# Altium schematic sheet USBPowerv1.0.SchDoc
size A3
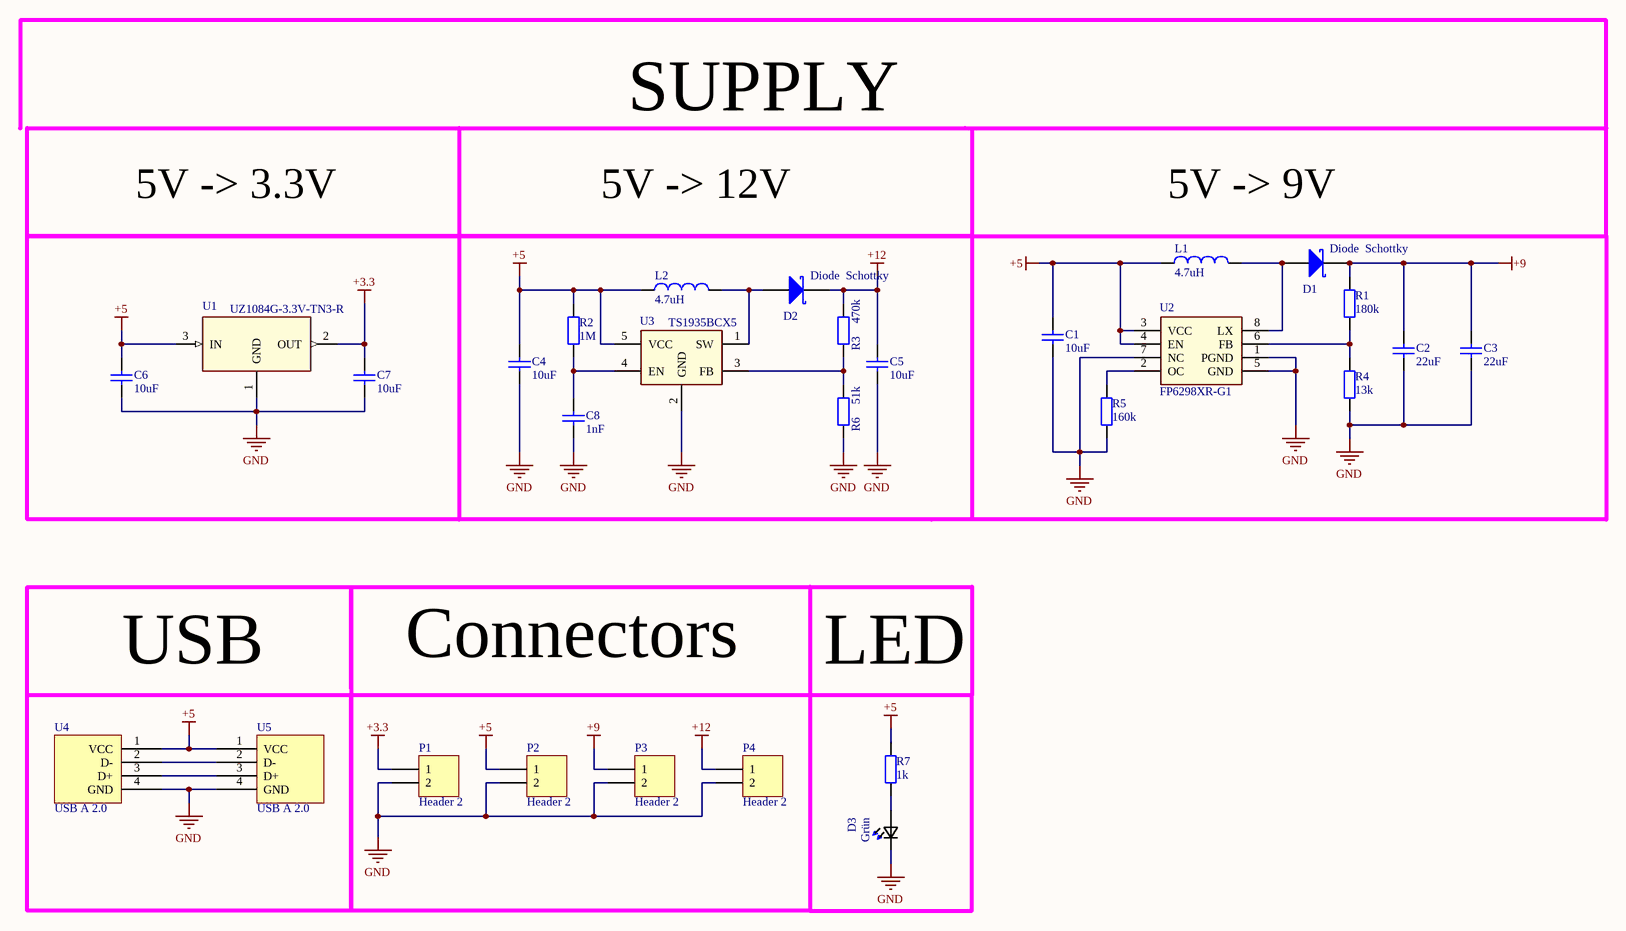
[diagram p0: USBPowerv1.0.SchDoc]

## Parts
C1  10uF  [CAP_0603i_1608m -L]
C2  22uF  [CAP_0805i_2012m -N]
C3  22uF  [CAP_0805i_2012m -N]
C4  10uF  [CAP_0603i_1608m -L]
C5  10uF  [CAP_0603i_1608m -L]
C6  10uF  [CAP_0603i_1608m -L]
C7  10uF  [CAP_0603i_1608m -L]
C8  1nF  [CAP_0402i_1005m -N]
D1  Diode  Schottky  [SOD123]
D2  Diode  Schottky  [SOD123]
D3  Grün  [*0603]
L1  4.7uH  [IND_0603i_1608m -L]
L2  4.7uH  [IND_0603i_1608m -L]
P1  Header 2  [3.81mm HDR1X2]
P2  Header 2  [3.81mm HDR1X2]
P3  Header 2  [3.81mm HDR1X2]
P4  Header 2  [3.81mm HDR1X2]
R1  180k  [RES_0603_1608m -L]
R2  1M  [RES_0603i_1608m -N]
R3  470k  [RES_0603i_1608m -N]
R4  13k  [RES_0603_1608m -L]
R5  160k  [RES_0603_1608m -L]
R6  51k  [RES_0603i_1608m -N]
R7  1k  [RES_0603i_1608m -N]
U1  UZ1084G-3.3V-TN3-R  [TO-252-2]
U2  FP6298XR-G1  [SOP8]
U3  TS1935BCX5  [*SOT95P285X145-5N]
U4  USB A 2.0  [USB A 2.0 Male]
U5  USB A 2.0  [OST_USB-A1HSW6]

## Blocks framed on the sheet
USB: U4 U5

## Nets
+3.3: C7.2 P1.1 U1.2(OUT)
+5: C1.2 C4.2 C6.2 L1.1 L2.1 P2.1 R2.1 R7.2 U1.3(IN) U2.3(VCC) U2.4(EN) U3.5(VCC) U4.1(VCC) U5.1(VCC)
+9: C2.2 C3.2 D1.2(K) P3.1 R1.2
+12: C5.2 D2.2(K) P4.1 R3.1
GND: C1.1 C2.1 C3.1 C4.1 C5.1 C6.1 C7.1 C8.1 D3.1(K2) P1.2 P2.2 P3.2 P4.2 R4.1 R5.1 R6.2 U1.1(GND) U2.1(PGND) U2.5(GND) U2.7(NC) U3.2(GND) U4.4(GND) U5.4(GND)
NetC8_2: C8.2 R2.2 U3.4(EN)
NetD1_1: D1.1(A) L1.2 U2.8(LX)
NetD2_1: D2.1(A) L2.2 U3.1(SW)
NetD3_2: D3.2(A2) R7.1
NetR1_1: R1.1 R4.2 U2.6(FB)
NetR3_2: R3.2 R6.1 U3.3(FB)
NetR5_2: R5.2 U2.2(OC)
NetU4_2: U4.2(D-) U5.2(D-)
NetU4_3: U4.3(D+) U5.3(D+)

## Notes on the sheet
- SUPPLY
- 5V -> 3.3V
- 5V -> 12V
- 5V -> 9V
- Connectors
- LED
- 1
- 2
- 3
- 4
- 5
- 6
- 7
- 8
- A
- B
- C
- D
- Project:
- Date:
- Drawing number:
- Rev:
- Format:
- A3
- Drawn by:
- Laboratory:
- Page
- Sheet:
- of
- File:

## Library data of the parts
C1-C8 = Cap: capacitor
D1 D2 = Diode  Schottky: Schottky Diode
D3 = LTST-C191KGKT: / LED; SMD; 0603; grün; 35mcd; 1.6x0.8x0.55mm; 130Â°; 2Ã·2.V; 20mA /; MF: Lite-On Inc.; Digi-Key_Purchase_URL: https://www.digikey.ch/product-detail/de/lite-on-inc/LTST-C191KGKT/160-1446-1-ND/386834; SnapEDA_Link: https://www.snapeda.com/parts/LTST-C191KFKT/Lite-On%20Inc./view-part/?ref=snap; MP: LTST-C191KGKT; Digi-Key_Part_Number: 160-1446-1-ND; Package: 0603 Lite-On; Value: *
L1 L2 = Inductor
P1-P4 = Header 2: Header, 2-Pin
R1 R4 R5 R7 = Res: Resistor
R2 R3 R6 = Res
U1 = UZ1084G-3.3V-TN3-R: LINEAR VOLTAGE REGULATORS TO-252-2(DPAK) ROHS; MF: Diodes Inc.; MP: AZ1117D-3.3TRE1; Availability: Unavailable; SnapEDA_Link: https://www.snapeda.com/parts/AZ1117D-3.3TRE1/Diodes%20Inc./view-part/856390/?ref=snap; Package: TO-252-2 Diodes Inc.; Price: None; Value: *
U3 = TS1935BCX5: TS1935BCX5 Boost-Schaltregler Adj 1,9A 2,6-5,5Vi SOT23-5